# Altium project RaspberryPi_Hat.PrjPCB
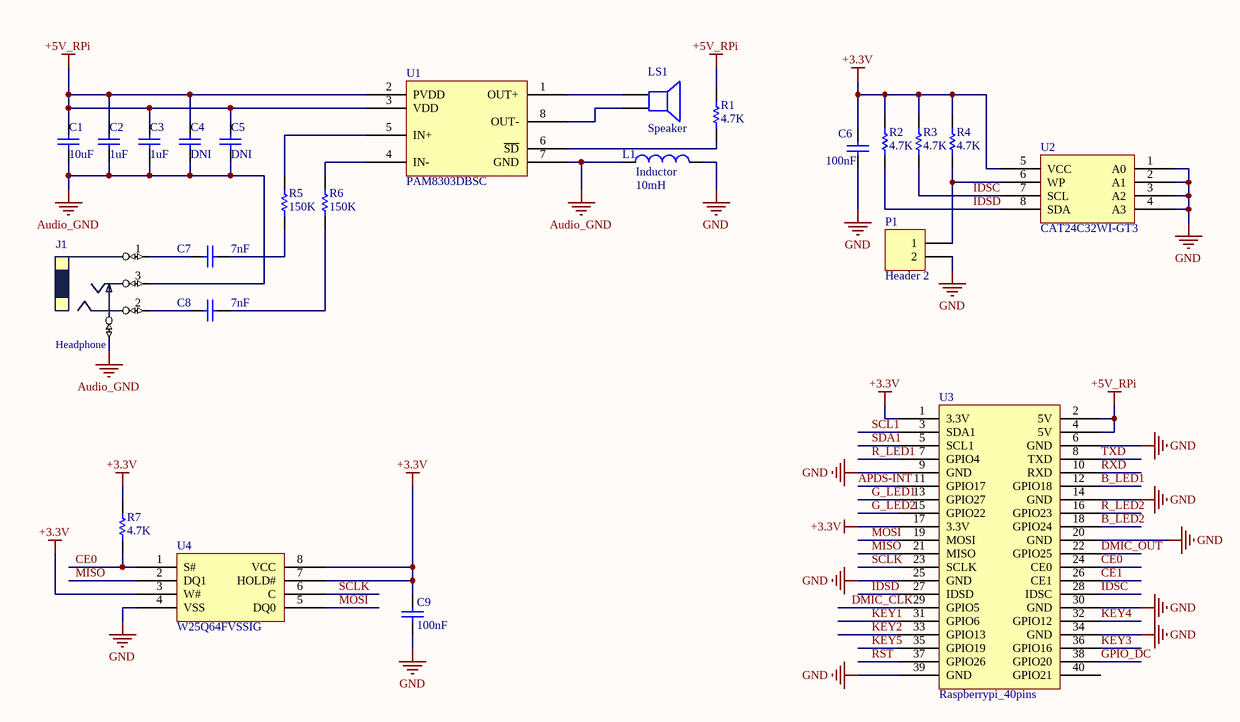
[diagram p0: Audio_Flash_eeprom.SchDoc]
3 sheets, 87 parts. Net scope: global (net labels, ports and power ports of the same name join across sheets).
Board file: Copy of RasperryPi_Hat22.PcbDoc
Sheets:
  Audio_Flash_eeprom.SchDoc
  OLED.SchDoc
  Key_RGB_Sensor_Uart.SchDoc

## Sheet Audio_Flash_eeprom.SchDoc: RapberryPi_Hat
size A4; Revision: V0.1; SheetNumber: X; SheetTotal: Y; Function: 数字功放，Flash，EEProm; number: 1; totle: 3

### Parts
C1  10uF  [C0603]
C2  1uF  [C0603]
C3  1uF  [C0603]
C4  DNI  [C0603]
C5  DNI  [C0603]
C6  100nF  [C0603]
C7  7nF  [C0603]
C8  7nF  [C0603]
C9  100nF  [C0603]
J1  Headphone  [AudioJack]
L1  Inductor  value 10mH  [C0603]
LS1  Speaker  [Speaker]
P1  Header 2  [HDR1X2]
R1  4.7K  [R0603]
R2  4.7K  [R0603]
R3  4.7K  [R0603]
R4  4.7K  [R0603]
R5  150K  [R0603]
R6  150K  [R0603]
R7  4.7K  [R0603]
U1  PAM8303DBSC  [MSOP8]
U2  CAT24C32WI-GT3  [SOP-8]
U3  Raspberrypi_40pins  [SMT_2*20_2.54]
U4  W25Q64FVSSIG  [SOIC8]

### Nets
+3.3V: C6.2 C9.2 R2.2 R3.2 R4.2 R7.2 U2.5(VCC) U3.1(3.3V) U3.17(3.3V) U4.3(W#) U4.7(HOLD#) U4.8(VCC)
+5V_RPi: C1.2 C2.2 C3.2 C4.2 C5.2 R1.2 U1.2(PVDD) U1.3(VDD) U3.2(5V) U3.4(5V)
Audio_GND: C1.1 C2.1 C3.1 C4.1 C5.1 J1.3 J1.4 L1.1 U1.7(GND)
GND: C6.1 C9.1 L1.2 P1.2 U2.1(A0) U2.2(A1) U2.3(A2) U2.4(A3) U3.6(GND) U3.9(GND) U3.14(GND) U3.20(GND) U3.25(GND) U3.30(GND) U3.34(GND) U3.39(GND) U4.4(VSS)
APDS-INT: U3.11(GPIO17)
B_LED1: U3.12(GPIO18)
B_LED2: U3.18(GPIO24)
CE0: R7.1 U3.24(CE0) U4.1(S#)
CE1: U3.26(CE1)
DMIC_CLK: U3.29(GPIO5)
DMIC_OUT: U3.22(GPIO25)
G_LED1: U3.13(GPIO27)
G_LED2: U3.15(GPIO22)
GPIO_DC: U3.38(GPIO20)
IDSC: R3.1 U2.7(SCL) U3.28(IDSC)
IDSD: R2.1 U2.8(SDA) U3.27(IDSD)
KEY1: U3.31(GPIO6)
KEY2: U3.33(GPIO13)
KEY3: U3.36(GPIO16)
KEY4: U3.32(GPIO12)
KEY5: U3.35(GPIO19)
MISO: U3.21(MISO) U4.2(DQ1)
MOSI: U3.19(MOSI) U4.5(DQ0)
R_LED1: U3.7(GPIO4)
R_LED2: U3.16(GPIO23)
RST: U3.37(GPIO26)
RXD: U3.10(RXD)
SCL1: U3.3(SDA1)
SCLK: U3.23(SCLK) U4.6(C)
SDA1: U3.5(SCL1)
TXD: U3.8(TXD)
NetC7_1: C7.1 R5.2
NetC7_2: C7.2 J1.1(L)
NetC8_1: C8.1 R6.2
NetC8_2: C8.2 J1.2(R)
NetLS1_1: LS1.1 U1.1(OUT+)
NetLS1_2: LS1.2 U1.8(OUT-)
NetP1_1: P1.1 R4.1 U2.6(WP)
NetR1_1: R1.1 U1.6(~{SD})
NetR5_1: R5.1 U1.5(IN+)
NetR6_1: R6.1 U1.4(IN-)

Not connected (* = marked no-connect by the designer): U3 40(GPIO21)

### Notes on the sheet
- 工程名称：
- 图纸大小：
- 日期：
- A4
- 版本号：
- 页码：
- 第
- 共
- 制图：
- 审核：

### Library data of the parts
C1-C8 = Cap Semi: Capacitor (Semiconductor SIM Model); Published: 8-Jun-2000; LatestRevisionDate: 29-May-2009; LatestRevisionNote: IPC-7351 Footprint Added.; PackageReference: C1206; Publisher: Altium Limited; PackageDescription: Chip Capacitor
  C1: Value: 10uF
  C2 C3: Value: 1uF
  C4 C5: Value: DNI
  C6: Value: 100nF
  C7 C8: Value: 7nF
C9 = Cap: Capacitor; Value: 100nF 封装0402 精度20% 耐压值6.3V以上; Published: 8-Jun-2000; LatestRevisionDate: 17-Jul-2002; LatestRevisionNote: Re-released for DXP Platform.; PackageReference: RAD-0.3; Publisher: Altium Limited; PackageDescription: Radial Cap, Thru-Hole; 2 Leads; 0.3 in Pin Spacing
J1 = PHONEJACK1
L1 = Inductor: Code_IEC: 1005; Published: 8-Jun-2000; LatestRevisionDate: 29-May-2009; LatestRevisionNote: IPC-7351 Footprint Added.; PackageReference: 0402-A; Publisher: Altium Limited; PackageDescription: Chip Inductor; Code_JEITA: 0402
LS1 = Speaker: Loudspeaker; Published: 24-Mar-1999; LatestRevisionDate: 17-Jul-2002; LatestRevisionNote: Re-released for DXP Platform.; PackageReference: PIN2; Publisher: Altium Limited
P1 = Header 2: Header, 2-Pin; LatestRevisionDate: 17-Jul-2002; LatestRevisionNote: Re-released for DXP Platform.; Publisher: Altium Limited
R1-R6 = Res1: Resistor; Published: 8-Jun-2000; LatestRevisionDate: 17-Jul-2002; LatestRevisionNote: Re-released for DXP Platform.; PackageReference: AXIAL-0.3; Publisher: Altium Limited; PackageDescription: Axial Device, Thru-Hole; 2 Leads; 0.3 in Pin Spacing
  R1-R4: Value: 4.7K
  R5 R6: Value: 150K
R7 = Res1: Resistor; Value: 10K 封装0402  精度5%; Published: 8-Jun-2000; LatestRevisionDate: 17-Jul-2002; LatestRevisionNote: Re-released for DXP Platform.; PackageReference: AXIAL-0.3; Publisher: Altium Limited; PackageDescription: Axial Device, Thru-Hole; 2 Leads; 0.3 in Pin Spacing
U1 = PAM8303D
U2 = CAT24C32WI-GT3: Raspiberry Config EEProm
U3 = Raspberrypi_40pins: 树莓派40pin管脚
U4 = M25P32-VMW6TG: Value: W25Q64FVSSIG

## Sheet OLED.SchDoc: RaspberryPi_Hat
size A4; Revision: V0.1; SheetNumber: X; SheetTotal: Y; Function: OLED; number: 2; totle: 3
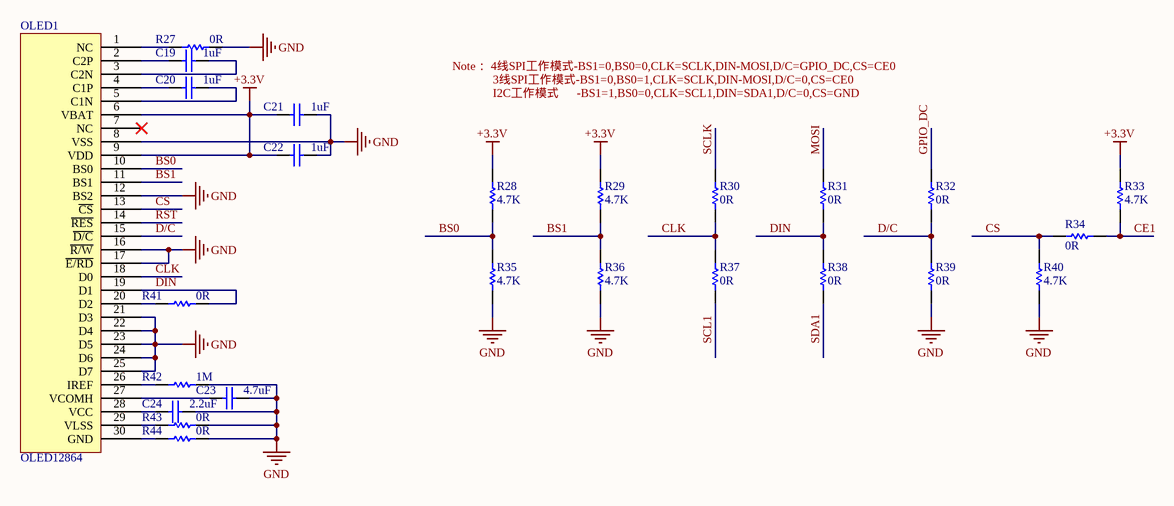
[diagram p1: OLED.SchDoc]

### Parts
C19  1uF  [C0603]
C20  1uF  [C0603]
C21  1uF  [C0603]
C22  1uF  [C0603]
C23  4.7uF  [C0603]
C24  2.2uF  [C0603]
OLED1  OLED12864  [OLED_128*64_0.96_30PIN]
R27  0R  [R0603]
R28  4.7K  [R0603]
R29  4.7K  [R0603]
R30  0R  [R0603]
R31  0R  [R0603]
R32  0R  [R0603]
R33  4.7K  [R0603]
R34  0R  [R0603]
R35  4.7K  [R0603]
R36  4.7K  [R0603]
R37  0R  [R0603]
R38  0R  [R0603]
R39  0R  [R0603]
R40  4.7K  [R0603]
R41  0R  [R0603]
R42  1M  [R0603]
R43  0R  [R0603]
R44  0R  [R0603]

### Nets
+3.3V: C21.2 C22.2 OLED1.6(VBAT) OLED1.9(VDD) R28.1 R29.1 R33.1
GND: C21.1 C22.1 C23.1 C24.1 OLED1.8(VSS) OLED1.12(BS2) OLED1.16(~{R/W}) OLED1.17(~{E/RD}) OLED1.21(D3) OLED1.22(D4) OLED1.23(D5) OLED1.24(D6) OLED1.25(D7) R27.1 R35.2 R36.2 R39.2 R40.2 R42.1 R43.1 R44.1
BS0: OLED1.10(BS0) R28.2 R35.1
BS1: OLED1.11(BS1) R29.2 R36.1
CE1: R33.2 R34.2
CLK: OLED1.18(D0) R30.2 R37.1
CS: OLED1.13(~{CS}) R34.1 R40.1
D/C: OLED1.15(~{D/C}) R32.2 R39.1
DIN: OLED1.19(D1) R31.2 R38.1 R41.1
GPIO_DC: R32.1
MOSI: R31.1
RST: OLED1.14(~{RES})
SCL1: R37.2
SCLK: R30.1
SDA1: R38.2
NetC19_1: C19.1 OLED1.3(C2N)
NetC19_2: C19.2 OLED1.2(C2P)
NetC20_1: C20.1 OLED1.5(C1N)
NetC20_2: C20.2 OLED1.4(C1P)
NetC23_2: C23.2 OLED1.27(VCOMH)
NetC24_2: C24.2 OLED1.28(VCC)
NetOLED1_1: OLED1.1(NC) R27.2
NetOLED1_20: OLED1.20(D2) R41.2
NetOLED1_26: OLED1.26(IREF) R42.2
NetOLED1_29: OLED1.29(VLSS) R43.2
NetOLED1_30: OLED1.30(GND) R44.2

Not connected (* = marked no-connect by the designer): OLED1 7(NC)*

### Notes on the sheet
- Note： 4线SPI工作模式-BS1=0,BS0=0,CLK=SCLK,DIN-MOSI,D/C=GPIO_DC,CS=CE0
- 3线SPI工作模式-BS1=0,BS0=1,CLK=SCLK,DIN-MOSI,D/C=0,CS=CE0
- I2C工作模式      -BS1=1,BS0=0,CLK=SCL1,DIN=SDA1,D/C=0,CS=GND
- 工程名称：
- 图纸大小：
- 日期：
- A4
- 版本号：
- 页码：
- 第
- 共
- 制图：
- 审核：

### Library data of the parts
C19-C24 = Cap Semi: Capacitor (Semiconductor SIM Model); Published: 8-Jun-2000; LatestRevisionDate: 29-May-2009; LatestRevisionNote: IPC-7351 Footprint Added.; PackageReference: C1206; Publisher: Altium Limited; PackageDescription: Chip Capacitor
  C19-C22: Value: 1uF
  C23: Value: 4.7uF
  C24: Value: 2.2uF
OLED1 = OLED12864: OLED 12864 0.9inch
R27-R44 = Res1: Resistor; Published: 8-Jun-2000; LatestRevisionDate: 17-Jul-2002; LatestRevisionNote: Re-released for DXP Platform.; PackageReference: AXIAL-0.3; Publisher: Altium Limited; PackageDescription: Axial Device, Thru-Hole; 2 Leads; 0.3 in Pin Spacing
  R27 R30-R32 R34 R37-R39 R41 R43 R44: Value: 0R
  R28 R29 R33 R35 R36 R40: Value: 4.7K
  R42: Value: 1M

## Sheet Key_RGB_Sensor_Uart.SchDoc: RaspberryPi_Hat
size A4; Revision: V0.1; SheetNumber: X; SheetTotal: Y; Function: 按键，RGB, 传感器，串口; number: 3; totle: 3
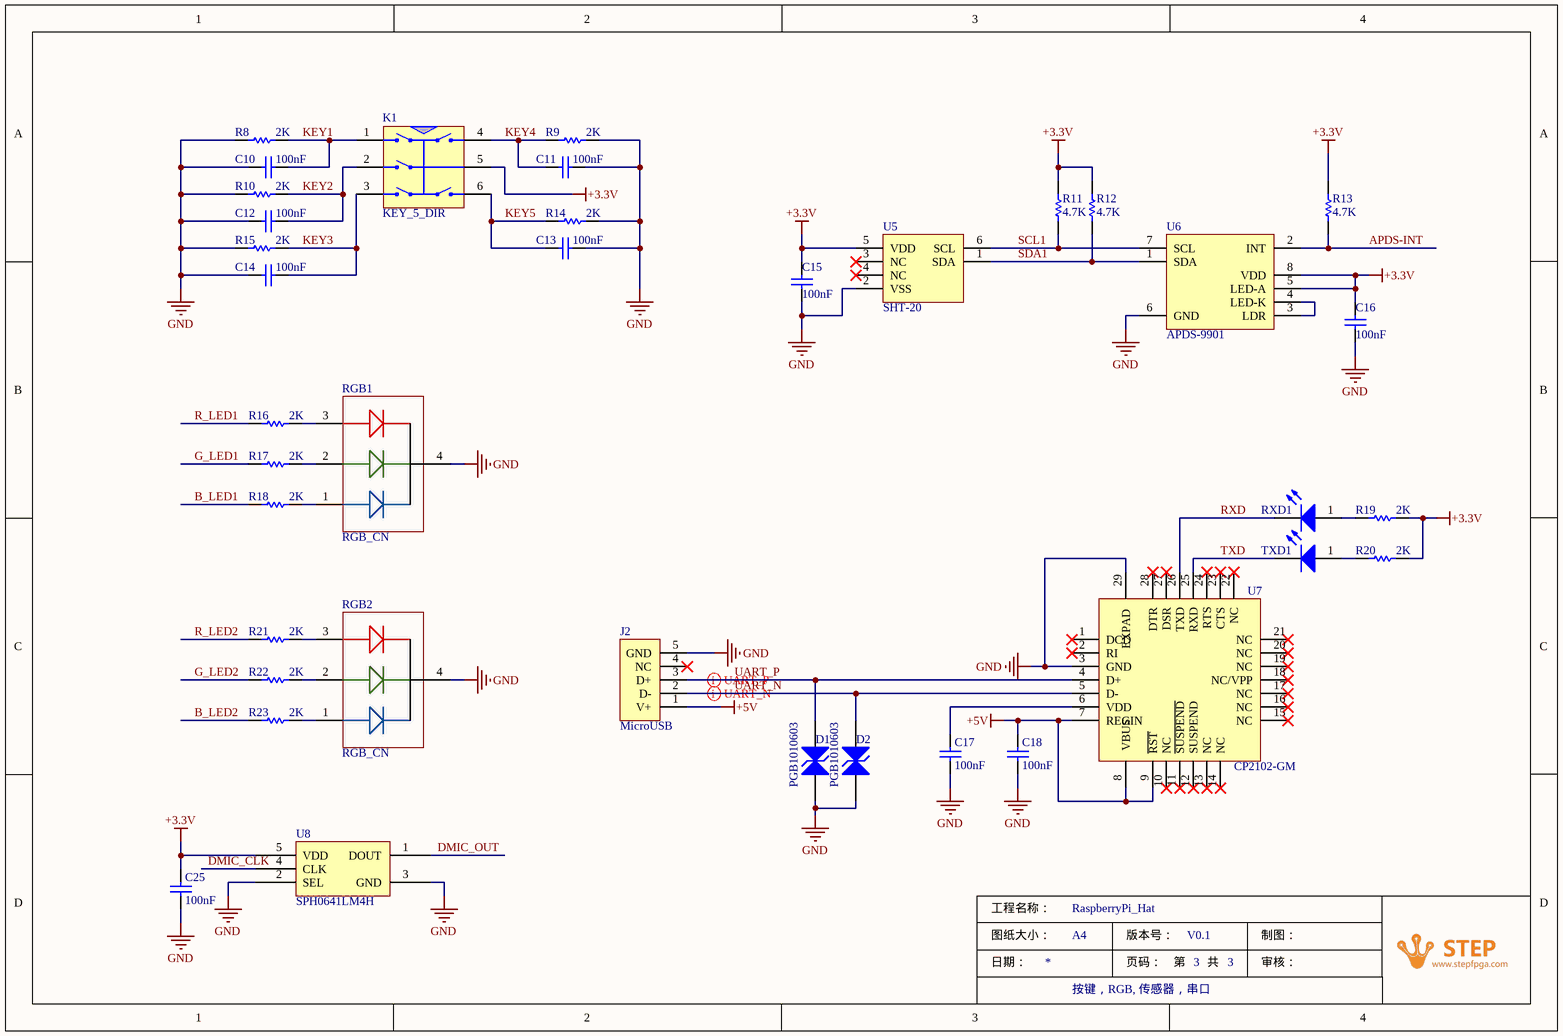
[diagram p2: Key_RGB_Sensor_Uart.SchDoc]

### Parts
C10  100nF  [C0603]
C11  100nF  [C0603]
C12  100nF  [C0603]
C13  100nF  [C0603]
C14  100nF  [C0603]
C15  100nF  [C0603]
C16  100nF  [C0603]
C17  100nF  [C0603]
C18  100nF  [C0603]
C25  100nF  [C0603]
D1  PGB1010603  [C0603]
D2  PGB1010603  [C0603]
J2  MicroUSB  [MICRO_USB_4]
K1  KEY_5_DIR  [KEY-CH5]
R8  2K  [R0603]
R9  2K  [R0603]
R10  2K  [R0603]
R11  4.7K  [R0603]
R12  4.7K  [R0603]
R13  4.7K  [R0603]
R14  2K  [R0603]
R15  2K  [R0603]
R16  2K  [R0603]
R17  2K  [R0603]
R18  2K  [R0603]
R19  2K  [R0603]
R20  2K  [R0603]
R21  2K  [R0603]
R22  2K  [R0603]
R23  2K  [R0603]
RGB1  RGB_CN  [RGB_LEDCN]
RGB2  RGB_CN  [RGB_LEDCN]
RXD1  LED  [LED0603]  (value not drawn)
TXD1  LED  [LED0603]  (value not drawn)
U5  SHT-20  [SHT20]
U6  APDS-9901  [APDS9901]
U7  CP2102-GM  [QFN5*5_28]
U8  SPH0641LM4H  [SPH(3.5*2.65)]

### Nets
+3.3V: C15.2 C16.2 C25.2 K1.5(COM) R11.2 R12.2 R13.2 R19.1 R20.1 U5.5(VDD) U6.5(LED-A) U6.8(VDD) U8.5(VDD)
+5V: C18.2 J2.1(V+) U7.7(REGIN) U7.8(VBUS) U7.9(~{RST})
GND: C10.2 C11.1 C12.2 C13.1 C14.2 C15.1 C16.1 C17.1 C18.1 C25.1 D1.1(A) D2.1(A) J2.5(GND) R8.2 R9.1 R10.2 R14.1 R15.2 RGB1.4(COM) RGB2.4(COM) U5.2(VSS) U6.6(GND) U7.3(GND) U7.29(EXPAD) U8.2(SEL) U8.3(GND)
APDS-INT: R13.1 U6.2(INT)
B_LED1: R18.2
B_LED2: R23.2
DMIC_CLK: U8.4(CLK)
DMIC_OUT: U8.1(DOUT)
G_LED1: R17.2
G_LED2: R22.2
KEY1: C10.1 K1.1(COM) R8.1
KEY2: C12.1 K1.2(COM) R10.1
KEY3: C14.1 K1.3(COM) R15.1
KEY4: C11.2 K1.4(COM) R9.2
KEY5: C13.2 K1.6(COM) R14.2
R_LED1: R16.2
R_LED2: R21.2
RXD: RXD1.2(K) U7.26(TXD)
SCL1: R11.1 U5.6(SCL) U6.7(SCL)
SDA1: R12.1 U5.1(SDA) U6.1(SDA)
TXD: TXD1.2(K) U7.25(RXD)
UART_N: D2.2(K) J2.2(D-) U7.5(D-)
UART_P: D1.2(K) J2.3(D+) U7.4(D+)
NetC17_2: C17.2 U7.6(VDD)
NetR16_1: R16.1 RGB1.3(G)
NetR17_1: R17.1 RGB1.2(G)
NetR18_1: R18.1 RGB1.1(B)
NetR19_2: R19.2 RXD1.1(A)
NetR20_2: R20.2 TXD1.1(A)
NetR21_1: R21.1 RGB2.3(G)
NetR22_1: R22.1 RGB2.2(G)
NetR23_1: R23.1 RGB2.1(B)
NetU6_3: U6.3(LDR) U6.4(LED-K)

Not connected (* = marked no-connect by the designer): J2 4(NC)*; U5 3(NC)* 4(NC)*; U7 1(DCD)* 2(RI)* 10(NC)* 11(~{SUSPEND})* 12(SUSPEND)* 13(NC)* 14(NC)* 15(NC)* 16(NC)* 17(NC)* 18(NC/VPP)* 19(NC)* 20(NC)* 21(NC)* 22(NC)* 23(CTS)* 24(RTS)* 27(DSR)* 28(DTR)*

### Layout directives
differential pair: UART_N, UART_P

### Notes on the sheet
- 工程名称：
- 图纸大小：
- 日期：
- A4
- 版本号：
- 页码：
- 第
- 共
- 制图：
- 审核：

### Library data of the parts
C10-C16 = Cap Semi: Capacitor (Semiconductor SIM Model); Published: 8-Jun-2000; LatestRevisionDate: 29-May-2009; LatestRevisionNote: IPC-7351 Footprint Added.; PackageReference: C1206; Publisher: Altium Limited; PackageDescription: Chip Capacitor; Value: 100nF
C17 C18 C25 = Cap: as C9 on sheet Audio_Flash_eeprom; Published: 8-Jun-2000; LatestRevisionDate: 17-Jul-2002; LatestRevisionNote: Re-released for DXP Platform.; PackageReference: RAD-0.3; Publisher: Altium Limited; PackageDescription: Radial Cap, Thru-Hole; 2 Leads; 0.3 in Pin Spacing
D1 D2 = PGB1010603: ESD 抑制器 0603 24VDC .06pF; Manufacture: Littelfuse; Value: ESD抑制器 PGB1010603MR
J2 = Micro USB Header: FootPrint: *; Part Number: *; Price: *; Manufacture: *
K1 = KEY_5_DIR: 五向按键开关，摇杆; Value: 五向开关
R8-R23 = Res1: Resistor; Published: 8-Jun-2000; LatestRevisionDate: 17-Jul-2002; LatestRevisionNote: Re-released for DXP Platform.; PackageReference: AXIAL-0.3; Publisher: Altium Limited; PackageDescription: Axial Device, Thru-Hole; 2 Leads; 0.3 in Pin Spacing
  R8-R10 R14-R23: Value: 2K
  R11-R13: Value: 4.7K
RXD1 TXD1 = LED: Typical INFRARED GaAs LED,1.8V,10mA,Red; Value: 贴片LED 0603封装 绿色; Part Number: *; FootPrint: *; Manufacture: *
U5 = SHT-20: 温湿度传感器; Value: SHT-20
U6 = APDS-9901: 接近式传感器; Value: APDS-9901
U7 = CP2102: CP2102，USB转串口UART驱动芯片; Value: CP2102-GM
U8 = SPH0641LM4H: 数字麦克风

## Nets that join several sheets
+3.3V: Audio_Flash_eeprom (12 pins), OLED (7 pins), Key_RGB_Sensor_Uart (13 pins)
GND: Audio_Flash_eeprom (17 pins), OLED (21 pins), Key_RGB_Sensor_Uart (26 pins)
APDS-INT: Audio_Flash_eeprom (U3.11), Key_RGB_Sensor_Uart (R13.1 U6.2)
B_LED1: Audio_Flash_eeprom (U3.12), Key_RGB_Sensor_Uart (R18.2)
B_LED2: Audio_Flash_eeprom (U3.18), Key_RGB_Sensor_Uart (R23.2)
CE1: Audio_Flash_eeprom (U3.26), OLED (R33.2 R34.2)
DMIC_CLK: Audio_Flash_eeprom (U3.29), Key_RGB_Sensor_Uart (U8.4)
DMIC_OUT: Audio_Flash_eeprom (U3.22), Key_RGB_Sensor_Uart (U8.1)
G_LED1: Audio_Flash_eeprom (U3.13), Key_RGB_Sensor_Uart (R17.2)
G_LED2: Audio_Flash_eeprom (U3.15), Key_RGB_Sensor_Uart (R22.2)
GPIO_DC: Audio_Flash_eeprom (U3.38), OLED (R32.1)
KEY1: Audio_Flash_eeprom (U3.31), Key_RGB_Sensor_Uart (C10.1 K1.1 R8.1)
KEY2: Audio_Flash_eeprom (U3.33), Key_RGB_Sensor_Uart (C12.1 K1.2 R10.1)
KEY3: Audio_Flash_eeprom (U3.36), Key_RGB_Sensor_Uart (C14.1 K1.3 R15.1)
KEY4: Audio_Flash_eeprom (U3.32), Key_RGB_Sensor_Uart (C11.2 K1.4 R9.2)
KEY5: Audio_Flash_eeprom (U3.35), Key_RGB_Sensor_Uart (C13.2 K1.6 R14.2)
MOSI: Audio_Flash_eeprom (U3.19 U4.5), OLED (R31.1)
R_LED1: Audio_Flash_eeprom (U3.7), Key_RGB_Sensor_Uart (R16.2)
R_LED2: Audio_Flash_eeprom (U3.16), Key_RGB_Sensor_Uart (R21.2)
RST: Audio_Flash_eeprom (U3.37), OLED (OLED1.14)
RXD: Audio_Flash_eeprom (U3.10), Key_RGB_Sensor_Uart (RXD1.2 U7.26)
SCL1: Audio_Flash_eeprom (U3.3), OLED (R37.2), Key_RGB_Sensor_Uart (R11.1 U5.6 U6.7)
SCLK: Audio_Flash_eeprom (U3.23 U4.6), OLED (R30.1)
SDA1: Audio_Flash_eeprom (U3.5), OLED (R38.2), Key_RGB_Sensor_Uart (R12.1 U5.1 U6.1)
TXD: Audio_Flash_eeprom (U3.8), Key_RGB_Sensor_Uart (TXD1.2 U7.25)